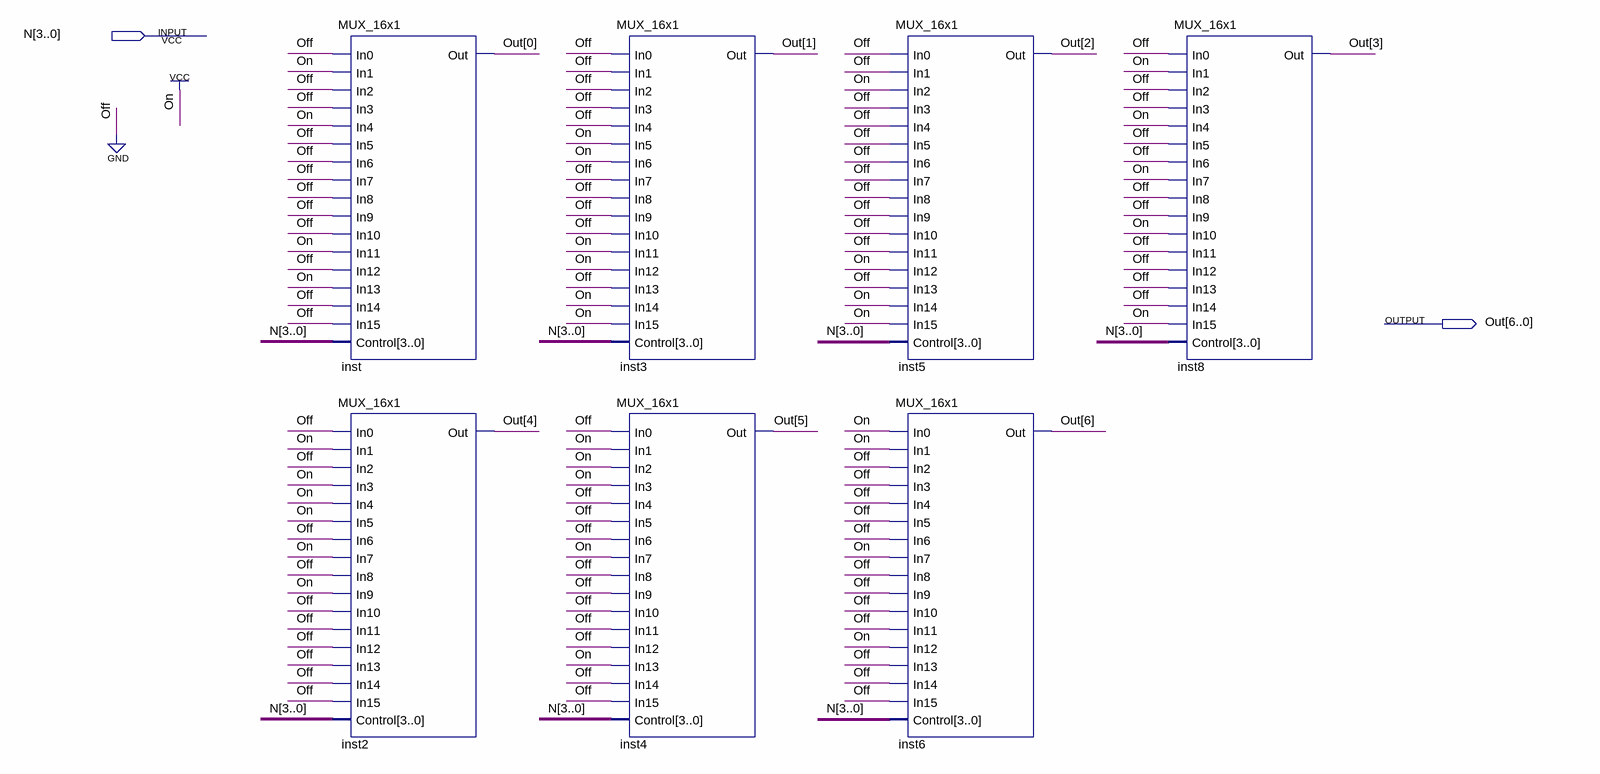
[diagram p0: schematic sheet]
// Quartus schematic 7S_DISPLAY.bdf as structural Verilog: 7 symbols, 2 pins
module \7S_DISPLAY  (
  input  [3:0] N,
  output [6:0] Out
);

  MUX_16x1 inst (
    .In0(1'b0), .In1(1'b1), .In2(1'b0), .In3(1'b0), .In4(1'b1), .In5(1'b0), .In6(1'b0), .In7(1'b0),
    .In8(1'b0), .In9(1'b0), .In10(1'b0), .In11(1'b1), .In12(1'b0), .In13(1'b1), .In14(1'b0), .In15(1'b0),
    .Control(N), .Out(Out[0]));
  MUX_16x1 inst2 (
    .In0(1'b0), .In1(1'b1), .In2(1'b0), .In3(1'b1), .In4(1'b1), .In5(1'b1), .In6(1'b0), .In7(1'b1),
    .In8(1'b0), .In9(1'b1), .In10(1'b0), .In11(1'b0), .In12(1'b0), .In13(1'b0), .In14(1'b0), .In15(1'b0),
    .Control(N), .Out(Out[4]));
  MUX_16x1 inst3 (
    .In0(1'b0), .In1(1'b0), .In2(1'b0), .In3(1'b0), .In4(1'b0), .In5(1'b1), .In6(1'b1), .In7(1'b0),
    .In8(1'b0), .In9(1'b0), .In10(1'b0), .In11(1'b1), .In12(1'b1), .In13(1'b0), .In14(1'b1), .In15(1'b1),
    .Control(N), .Out(Out[1]));
  MUX_16x1 inst4 (
    .In0(1'b0), .In1(1'b1), .In2(1'b1), .In3(1'b1), .In4(1'b0), .In5(1'b0), .In6(1'b0), .In7(1'b1),
    .In8(1'b0), .In9(1'b0), .In10(1'b0), .In11(1'b0), .In12(1'b0), .In13(1'b1), .In14(1'b0), .In15(1'b0),
    .Control(N), .Out(Out[5]));
  MUX_16x1 inst5 (
    .In0(1'b0), .In1(1'b0), .In2(1'b1), .In3(1'b0), .In4(1'b0), .In5(1'b0), .In6(1'b0), .In7(1'b0),
    .In8(1'b0), .In9(1'b0), .In10(1'b0), .In11(1'b0), .In12(1'b1), .In13(1'b0), .In14(1'b1), .In15(1'b1),
    .Control(N), .Out(Out[2]));
  MUX_16x1 inst6 (
    .In0(1'b1), .In1(1'b1), .In2(1'b0), .In3(1'b0), .In4(1'b0), .In5(1'b0), .In6(1'b0), .In7(1'b1),
    .In8(1'b0), .In9(1'b0), .In10(1'b0), .In11(1'b0), .In12(1'b1), .In13(1'b0), .In14(1'b0), .In15(1'b0),
    .Control(N), .Out(Out[6]));
  MUX_16x1 inst8 (
    .In0(1'b0), .In1(1'b1), .In2(1'b0), .In3(1'b0), .In4(1'b1), .In5(1'b0), .In6(1'b0), .In7(1'b1),
    .In8(1'b0), .In9(1'b0), .In10(1'b1), .In11(1'b0), .In12(1'b0), .In13(1'b0), .In14(1'b0), .In15(1'b1),
    .Control(N), .Out(Out[3]));
endmodule
